# EAGLE design μDrone_v1 (EAGLE 9.6.2)
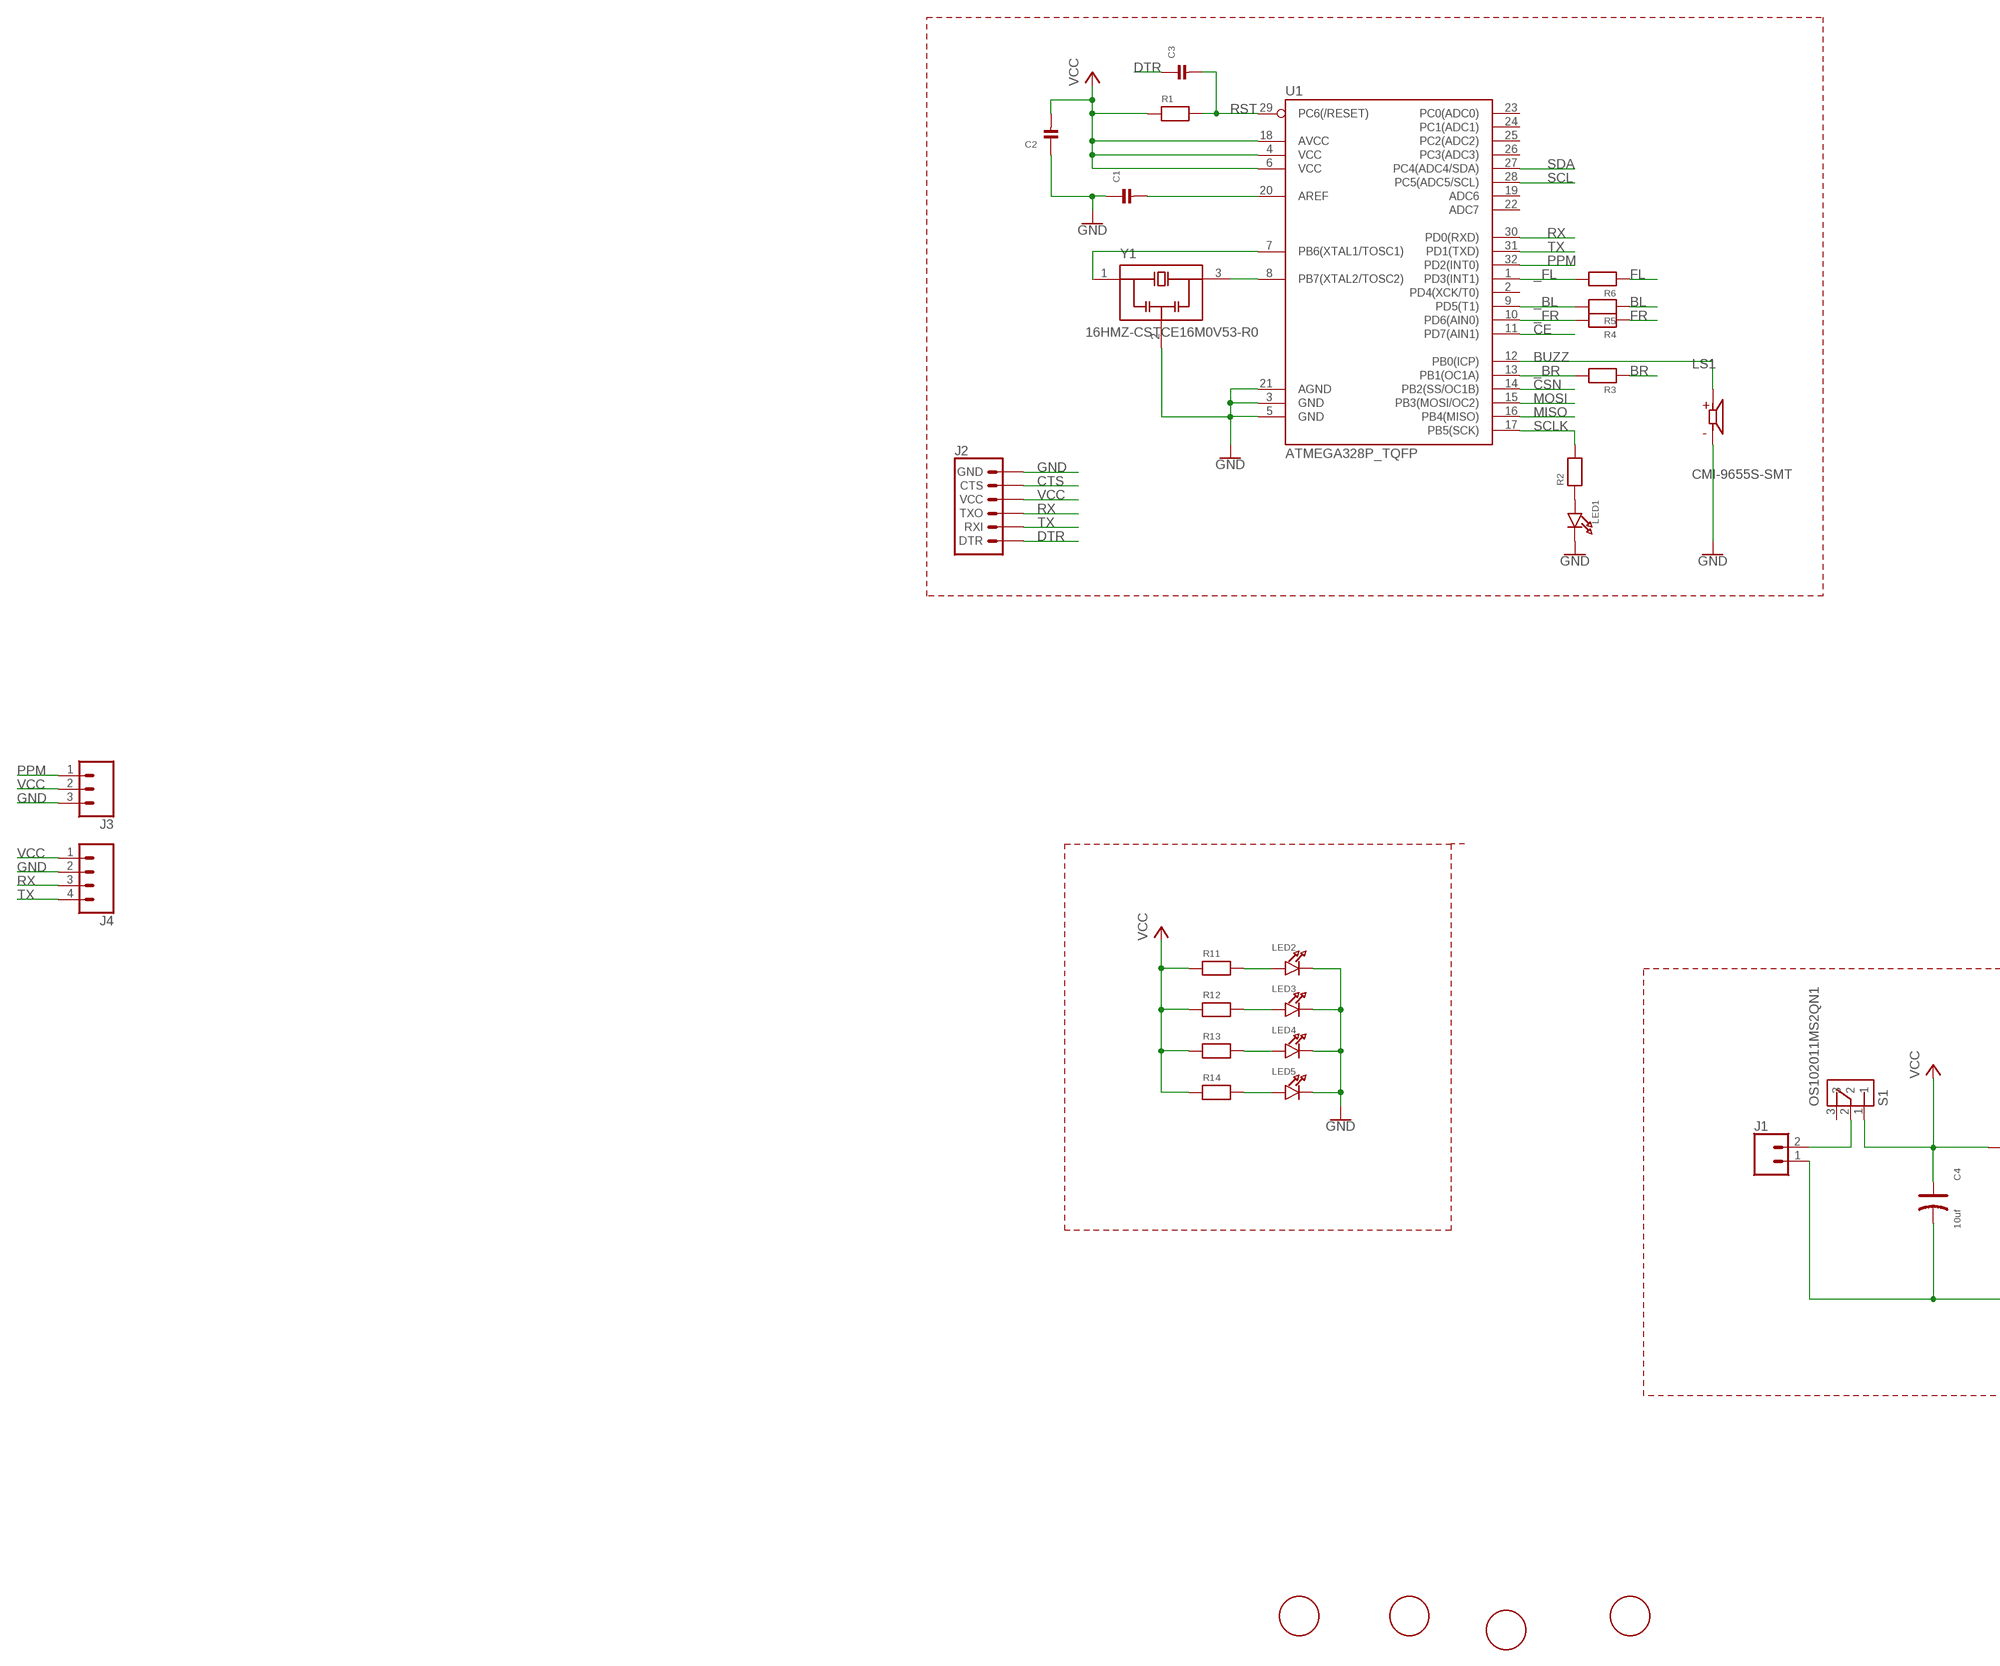
[diagram p0: schematic, sheet 1, part 1 of 2]
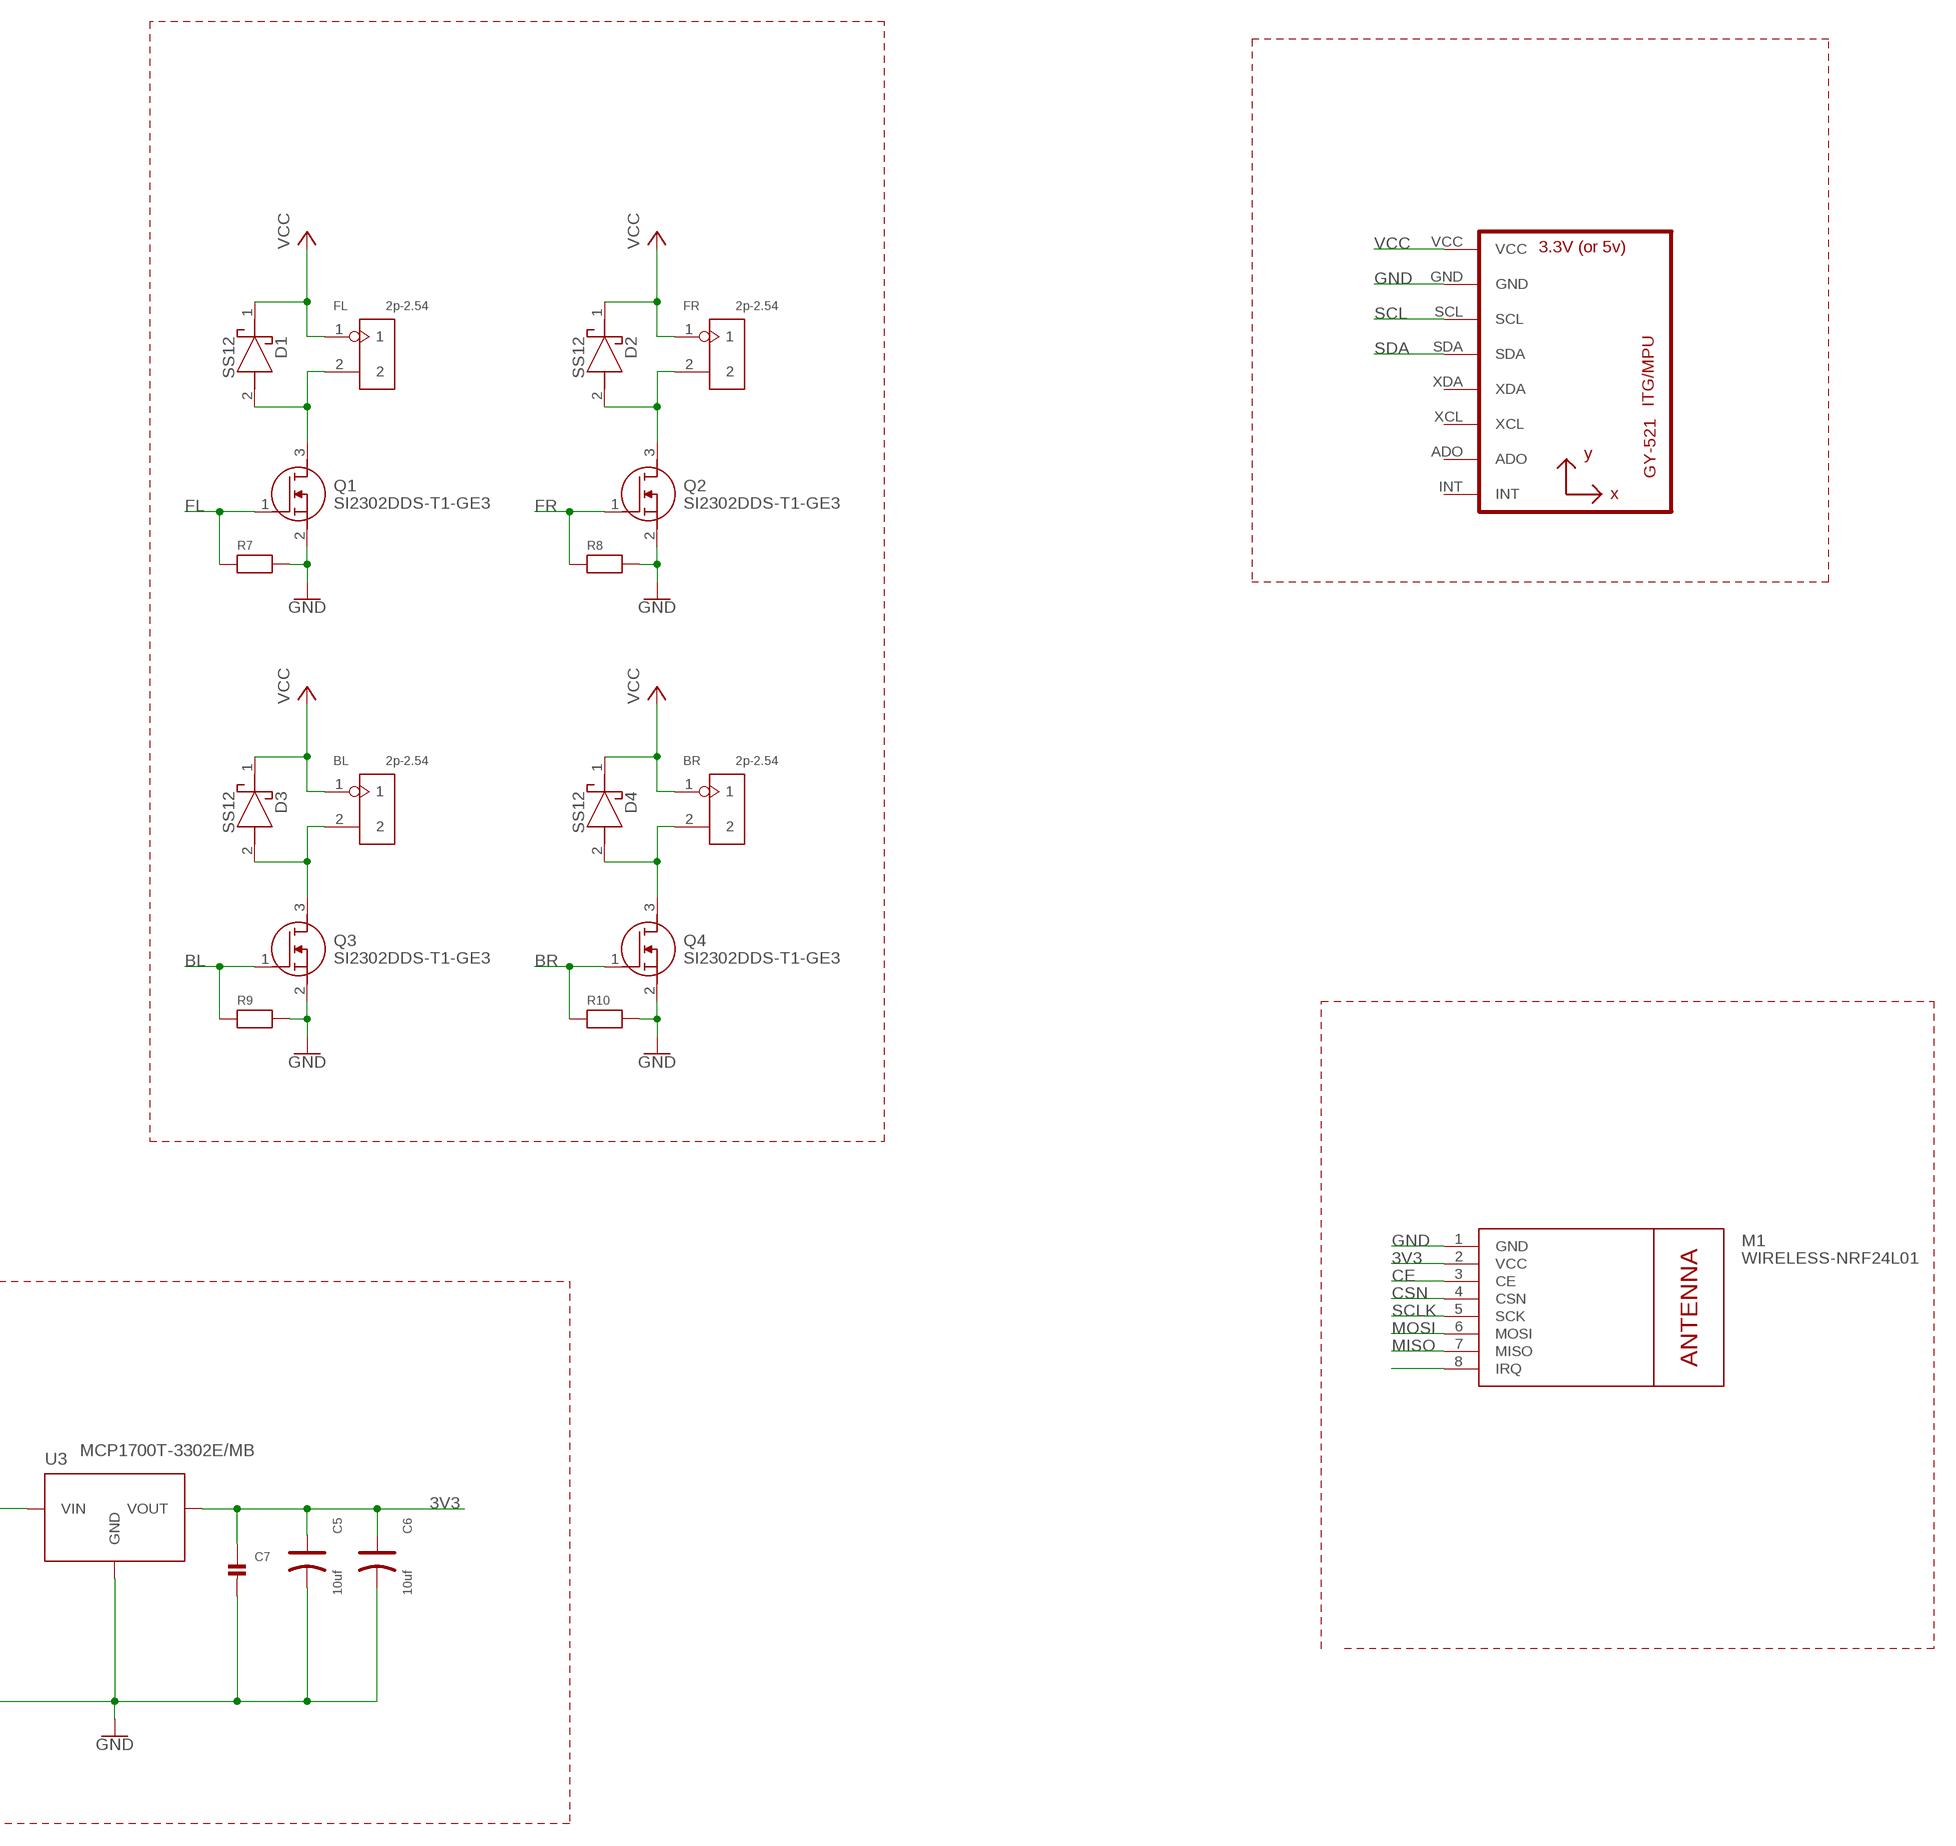
[diagram p1: schematic, sheet 1, part 2 of 2]

## Parts
BL  2p-2.54  DIP-BLACK-FEMALE-HEADER-VERT(2P-2.54)  [H2-2.54-F]
BR  2p-2.54  DIP-BLACK-FEMALE-HEADER-VERT(2P-2.54)  [H2-2.54-F]
C1  CAP_CERAMIC0805  [C0805]
C2  CAP_CERAMIC0805  [C0805]
C3  CAP_CERAMIC0805  [C0805]
C4  10uf  TANTALUM-SMD-10UF-16V-10%(AVX-A)  [AVX-A]
C5  10uf  TANTALUM-SMD-10UF-16V-10%(AVX-A)  [AVX-A]
C6  10uf  TANTALUM-SMD-10UF-16V-10%(AVX-A)  [AVX-A]
C7  CAP_CERAMIC0805  [C0805]
D1  SS12  [DIOM5227X250N]
D2  SS12  [DIOM5227X250N]
D3  SS12  [DIOM5227X250N]
D4  SS12  [DIOM5227X250N]
FL  2p-2.54  DIP-BLACK-FEMALE-HEADER-VERT(2P-2.54)  [H2-2.54-F]
FR  2p-2.54  DIP-BLACK-FEMALE-HEADER-VERT(2P-2.54)  [H2-2.54-F]
J1  CONN_02-JST-2-PTH-NO_SILK  [JST-2-PTH-NS]
J2  6_PIN_SERIAL_TARGETSILK  [6_PIN_SERIAL_TARGET_SIDE_W_SILK]
J3  CONN_03  [1X03]
J4  CONN_04  [1X04]
LED1  LED0805_NOOUTLINE  [CHIPLED_0805_NOOUTLINE]
LED2  LED0805  [CHIPLED_0805]
LED3  LED0805  [CHIPLED_0805]
LED4  LED0805  [CHIPLED_0805]
LED5  LED0805  [CHIPLED_0805]
LS1  CMI-9655S-SMT  [CUI_CMI-9655S-SMT]
M1  WIRELESS-NRF24L01  [WIRELESS-NRF24L01]
Q1  SI2302DDS-T1-GE3  [SOT95P237X112-3N]
Q2  SI2302DDS-T1-GE3  [SOT95P237X112-3N]
Q3  SI2302DDS-T1-GE3  [SOT95P237X112-3N]
Q4  SI2302DDS-T1-GE3  [SOT95P237X112-3N]
R1  RESISTOR0805  [R0805]
R2  RESISTOR0805  [R0805]
R3  RESISTOR0805  [R0805]
R4  RESISTOR0805  [R0805]
R5  RESISTOR0805  [R0805]
R6  RESISTOR0805  [R0805]
R7  RESISTOR0805  [R0805]
R8  RESISTOR0805  [R0805]
R9  RESISTOR0805  [R0805]
R10  RESISTOR0805  [R0805]
R11  RESISTOR0805  [R0805]
R12  RESISTOR0805  [R0805]
R13  RESISTOR0805  [R0805]
R14  RESISTOR0805  [R0805]
S1  OS102011MS2QN1  [SW_OS102011MS2QN1]
U1  ATMEGA328P_TQFP  [TQFP32-08]
U2  GY-521MPU6050  [GY-521]
U3  MCP1700T-3302E/MB  [MCP1700T-3302E/MB]
U$1  MICRO-DC-MOTOR-WITH-PROP  [MICRO-DC]
U$2  MICRO-DC-MOTOR-WITH-PROP  [MICRO-DC]
U$3  MICRO-DC-MOTOR-WITH-PROP  [MICRO-DC]
U$4  MICRO-DC-MOTOR-WITH-PROP  [MICRO-DC]
Y1  16HMZ-CSTCE16M0V53-R0  [OSC_CSTCE16M0V53-R0]

## Nets
3V3: C5.+ C6.+ C7.1 M1.2(VCC) U3.3(VOUT)
_BL: R5.2 U1.9(PD5(T1))
_BR: R3.2 U1.13(PB1(OC1A))
_FL: R6.2 U1.1(PD3(INT1))
_FR: R4.2 U1.10(PD6(AIN0))
BL: Q3.1(G) R5.1 R9.1
BR: Q4.1(G) R3.1 R10.1
BUZZ: LS1.P U1.12(PB0(ICP))
CE: M1.3(CE) U1.11(PD7(AIN1))
CSN: M1.4(CSN) U1.14(PB2(SS/OC1B))
CTS: J2.P$5(CTS)
DTR: C3.1 J2.P$1(DTR)
FL: Q1.1(G) R6.1 R7.1
FR: Q2.1(G) R4.1 R8.1
GND: C1.1 C2.1 C4.- C5.- C6.- C7.2 J1.1 J2.P$6(GND) J3.3 J4.2 LED1.C LED2.C LED3.C LED4.C LED5.C LS1.N M1.1(GND) Q1.2(S) Q2.2(S) Q3.2(S) Q4.2(S) R7.2 R8.2 R9.2 R10.2 U1.3(GND) U1.5(GND) U1.21(AGND) U2.GND U3.1(GND) Y1.2(GND)
IRQ: M1.8(IRQ)
MISO: M1.7(MISO) U1.16(PB4(MISO))
MOSI: M1.6(MOSI) U1.15(PB3(MOSI/OC2))
N$1: U1.8(PB7(XTAL2/TOSC2)) Y1.3(OUT)
N$2: LED1.A R2.1
N$3: C1.2 U1.20(AREF)
N$4: U1.7(PB6(XTAL1/TOSC1)) Y1.1(IN)
N$5: D2.2(A) FR.2 Q2.3(D)
N$6: D1.2(A) FL.2 Q1.3(D)
N$7: BL.2 D3.2(A) Q3.3(D)
N$8: BR.2 D4.2(A) Q4.3(D)
N$9: LED2.A R11.2
N$10: LED3.A R12.2
N$11: LED4.A R13.2
N$12: LED5.A R14.2
N$14: J1.2 S1.2
PPM: J3.1 U1.32(PD2(INT0))
RST: C3.2 R1.2 U1.29(PC6(/RESET))
RX: J2.P$2(TXO) J4.3 U1.30(PD0(RXD))
SCL: U1.28(PC5(ADC5/SCL)) U2.SCL
SCLK: M1.5(SCK) R2.2 U1.17(PB5(SCK))
SDA: U1.27(PC4(ADC4/SDA)) U2.SDA
TX: J2.P$3(RXI) J4.4 U1.31(PD1(TXD))
VCC: BL.1 BR.1 C2.2 C4.+ D1.1(K) D2.1(K) D3.1(K) D4.1(K) FL.1 FR.1 J2.P$4(VCC) J3.2 J4.1 R1.1 R11.1 R12.1 R13.1 R14.1 S1.1 U1.4(VCC) U1.6(VCC) U1.18(AVCC) U2.VCC U3.2(VIN) U3.2.1(VIN)
Unconnected: S1.3 U1.2(PD4(XCK/T0)) U1.19(ADC6) U1.22(ADC7) U1.23(PC0(ADC0)) U1.24(PC1(ADC1)) U1.25(PC2(ADC2)) U1.26(PC3(ADC3)) U2.ADO U2.INT U2.XCL U2.XDA

## Library data of the parts
BL BR FL FR = eventHorizon:DIP-BLACK-FEMALE-HEADER-VERT(2P-2.54): 320030023; MPN: F185-1102A1BSYA1
C1-C3 C7 = eventHorizon:CAP_CERAMIC: Ceramic Capacitors 0402 - 0402 Surface Mount Capacitors 16pF 50V 5% [Digikey: 445-4899-2-ND] 18pF 50V 5% [Digikey: 490-1281-2-ND] 22pF 50V 5% [Digikey: 490-1283-2-ND] 68pF 50V 5% [Digikey: 490-1289-2-ND] 0.1uF 10V 10% [Digikey: 490-1318-2-ND] 1.0uF 6.3V 10% [Digikey: 490-1320-2-ND] 0603 - 0603 Surface Mount Capacitors 16 pF 50V 5% [Digikey: 445-5051-2-ND] 22 pF 50V [Digikey: PCC220ACVTR-ND] 33 pF 50V 5% [Digikey: 490-1415-1-ND] 56pF 50V 5% [Digikey: 490-1421-1-ND] 220pF 50V 5% [Digikey: 445-1285-1-ND] 680 pF 50V 2200 pF 50V 5% C0G [Digikey: 445-1297-1-ND] 5600 pF 100V 5% X7R [Digikey: 478-3711-1-ND] 0.1 µF 25V 10% [Digikey: PCC2277TR-ND] 0.22 µF 16V 10% X7R [Digikey: 445-1318-1-ND] 1.0 µF 25V 10% [Digikey: 445-5146-2-ND] 0603 - RF Specific 3pF 250V +/-0.1pF RF [Digikey: 712-1347-1-ND] 18 pF 250V 5% [Digikey: 478-3505-1-ND or 712-1322-1-ND] 56 pF 250V 5% C0G RF [Digikey: 490-4867-1-ND] 68 pF 250V RF [Digikey: 490-4868-1-ND] 0805 - 0805 Surface Mount Capacitors 220 pF 250V 2% RF Ceramic Capacitor [Digikey: 712-1398-1-ND] 1000 pF 50V 2% NP0 Ceramic Capacitor [Digikey: 478-3760-1-ND] 0.1 µF 25V 10% Ceramic Capacitor [Digikey: PCC1828TR-ND] 1.0 µF 16V 10% Ceramic Capacitor[Digikey: 490-1691-2-ND] 10.0 µF 10V 10% Ceramic Capacitor[Digikey: 709-1228-1-ND] 10.0 uF 16V 10% Ceramic Capacitor [Digikey: 478-5165-2-ND] 47 uF 6.3V 20% Ceramic Capacitor [Digikey: 587-1779-1-ND or 399-5506-1-ND] 1206 - 1206 Surface Mount Capacitors 47uF 10V 20% Ceramic Capacitor [Digikey: 490-5528-1-ND or 399-5508-1-ND or 445-6010-1-ND] 100uF 6.3V -20%, +80% Y5V Ceramic Capacitor (Digikey: 490-4512-1-ND, Mouser: 81-GRM31CF50J107ZE1L)
C4-C6 = electroShri:TANTALUM-SMD-10UF-16V-10%(AVX-A): 302020002; MPN: TAJA106K016RNJ
D1-D4 = eventHorizon:SS12: ON Semi SS12 SMT Schottky Diode, 20V 1A, 2-Pin DO-214AC Source: Datasheet; DESCRIPTION: ON Semi SS12 SMT Schottky Diode, 20V 1A, 2-Pin DO-214AC; HEIGHT: 2.5mm; MANUFACTURER_NAME: ON Semiconductor; MANUFACTURER_PART_NUMBER: SS12; MOUSER_PART_NUMBER: 512-SS12; MOUSER_PRICE-STOCK: https://www.mouser.co.uk/ProductDetail/ON-Semiconductor-Fairchild/SS12?qs=mVVXn4M53U9WoaEpU1CO0A%3D%3D; RS_PART_NUMBER: 9034428; RS_PRICE-STOCK: https://uk.rs-online.com/web/p/products/9034428
J1 = eventHorizon:CONN_02: Multi connection point. Often used as Generic Header-pin footprint for 0.1 inch spaced/style header connections On any of the 0.1 inch spaced packages, you can populate with these: Break Away Headers - Straight (PRT-00116) Break Away Male Headers - Right Angle (PRT-00553) Female Headers (PRT-00115) Break Away Headers - Machine Pin (PRT-00117) Break Away Female Headers - Swiss Machine Pin (PRT-00743) For SCREWTERMINALS and SPRING TERMINALS visit here: Screw Terimnals on SparkFun.com (5mm/3.5mm/2.54mm spacing) This device is also useful as a general connection point to wire up your design to another part of your project. Our various solder wires solder well into these plated through hole pads. Hook-Up Wire - Assortment (Stranded, 22 AWG) (PRT-11375) Hook-Up Wire - Assortment (Solid Core, 22 AWG) (PRT-11367) View the entire wire category on our website here Special notes: Molex polarized connector foot print use with: PRT-08233 with associated crimp pins and housings. 2.54_SCREWTERM for use with PRT-10571. 3.5mm Screw Terminal footprints for PRT-08084 5mm Screw Terminal footprints for use with PRT-08432
J2 = electroShri:6_PIN_SERIAL_TARGET: 6-pin header connection for use with the "FTDI BASIC" pinout - TARGET SIDE. Also known as "Arduino Serial Program Header". It is used to mate with our FTDI Basic serial programmers using the Arduino IDE. Note, this device has "TARGET" in the name. It is intended to be used on a design that contains a target micro-controller that you wish to program. The "sister" device, named "CABLE" is inteneded to be used on a design that usually lives on the end of your USB cable and prvides the converter chip (FTDI232 or FTDI231x) to commnicate serial RX/TX. You can populate with some of these: Break Away Headers - Straight (PRT-00116) For reference (or to suit your programming needs) check out these designs: SparkFun FTDI Basic Breakout - 5V (DEV-09716) SparkFun FTDI Basic Breakout - 3.3V (DEV-09873) SparkFun FTDI SmartBasic (DEV-12935) SparkFun Beefy 3 - FTDI Basic Breakout (DEV-13746)
J3 = electroShri:CONN_03: Multi connection point. Often used as Generic Header-pin footprint for 0.1 inch spaced/style header connections On any of the 0.1 inch spaced packages, you can populate with these: Break Away Headers - Straight (PRT-00116) Break Away Male Headers - Right Angle (PRT-00553) Female Headers (PRT-00115) Break Away Headers - Machine Pin (PRT-00117) Break Away Female Headers - Swiss Machine Pin (PRT-00743) Stackable Header - 3 Pin (Female, 0.1") (PRT-13875) For SCREWTERMINALS and SPRING TERMINALS visit here: Screw Terimnals on SparkFun.com (5mm/3.5mm/2.54mm spacing) This device is also useful as a general connection point to wire up your design to another part of your project. Our various solder wires solder well into these plated through hole pads. Hook-Up Wire - Assortment (Stranded, 22 AWG) (PRT-11375) Hook-Up Wire - Assortment (Solid Core, 22 AWG) (PRT-11367) View the entire wire category on our website here Special notes: Molex polarized connector foot print use with SKU : PRT-08232 with associated crimp pins and housings.
J4 = electroShri:CONN_04: Multi connection point. Often used as Generic Header-pin footprint for 0.1 inch spaced/style header connections On any of the 0.1 inch spaced packages, you can populate with these: Break Away Headers - Straight (PRT-00116) Break Away Male Headers - Right Angle (PRT-00553) Female Headers (PRT-00115) Break Away Headers - Machine Pin (PRT-00117) Break Away Female Headers - Swiss Machine Pin (PRT-00743) For SCREWTERMINALS and SPRING TERMINALS visit here: Screw Terimnals on SparkFun.com (5mm/3.5mm/2.54mm spacing) This device is also useful as a general connection point to wire up your design to another part of your project. Our various solder wires solder well into these plated through hole pads. Hook-Up Wire - Assortment (Stranded, 22 AWG) (PRT-11375) Hook-Up Wire - Assortment (Solid Core, 22 AWG) (PRT-11367) View the entire wire category on our website here Special notes: Molex polarized connector foot print use with SKU : PRT-08231 with associated crimp pins and housings. 1MM SMD Version SKU: PRT-10208; PROD_ID: CONN-09696
LED1-LED5 = eventHorizon:LED: LED 0603 - 0603 Surface Mount Package 2mA: Green LED - Low Power (3.9mcd, 2ma, 1.7Vf) - Digikey: 475-2709-2-ND Orange LED - Low Power (9.8mcd, 2ma, 1.8Vf) - Digikey: 475-1194-2-ND Red LED - Low Power (5mcd, 2ma, 1.8Vf) - Digikey: 475-1195-2-ND Yellow LED - Low Power (7mcd, 2ma, 1.8Vf) - Digikey: 475-1196-2-ND 5mA: Blue LED - Low Power (17mcd, 5ma, 2.9Vf) - Digikey: LNJ937W8CRACT-ND 0805 - 0805 Surface Mount Package 2mA: Red LED (8.8mcd, 2mA, 1.8Vf, Clear) - Low Power [Digikey: 475-2510-1-ND] Green LED (5mcd, 2mA, 1.8Vf, Clear) - Low Power [Digikey: 475-2730-1-ND] Yellow LED (11.3mcd, 2mA, 1.8Vf, Clear) - Low Power [Digikey: 475-2555-1-ND] 20mA: Red LED (104mcd, 20mA, Diffused) - LS R976 [Digikey: 475-1278-6-ND] Red LED (12mcd, 20mA, 2.0Vf, Clear) - APT2012EC [Digikey: 754-1128-1-ND] Green LED (15mcd, 20mA, 2.2Vf, Clear) - APT2012GC [Digikey: 754-1131-1-ND] Orange LED (160mcd, 20mA, 2.1Vf, Clear) - APT2012SECK [Digikey: 754-1130-1-ND] 1206 - 1206 Surface Mount Package Green LED (26mcd, 20mA, Diffused) - LG N971 [Digikey: 475-1407-6-ND] Red LED (15mcd, 20mA, Diffused) - LH N974 [Digikey: 475-1416-6-ND]
LS1 = electroShri:CMI-9655S-SMT: 9.6 mm, 5 Vdc, 85 dB, 2.7 kHz, Surface Mount (SMT), Driving Circuit, Magnetic Audio Indicator Buzzer; AVAILABILITY: Unavailable; CUI_PURCHASE_URL: https://www.cuidevices.com/product/audio/buzzers/audio-indicators/cmi-9655s-smt-tr?utm_source=snapeda.com&utm_medium=referral&utm_campaign=snapedaBOM; DESCRIPTION: 9.6 mm, 5 Vdc, 85 dB, 2.7 kHz, Surface Mount (SMT), Driving Circuit, Magnetic Audio Indicator Buzzer; MF: CUI Devices; MP: CMI-9655S-SMT-TR; PACKAGE: CUI Inc.; PRICE: None
M1 = eventHorizon:WIRELESS-NRF24L01: 2.4 GHz Wireless Module based on NRF24L01 chip More details available here: http://www.electrodragon.com/w/NRF24L01 Click here to find device on ebay.com
Q1-Q4 = eventHorizon:SI2302DDS-T1-GE3: SI2302DDS-T1-GE3 N-Channel MOSFET, 2.6 A, 20 V, 3-Pin SOT-363 Vishay Source: Datasheet; ALLIED_NUMBER: 70459664; ALLIED_PRICE-STOCK: https://www.alliedelec.com/siliconix-vishay-si2302dds-t1-ge3/70459664/; DESCRIPTION: SI2302DDS-T1-GE3 N-Channel MOSFET, 2.6 A, 20 V, 3-Pin SOT-363 Vishay; HEIGHT: 1.12mm; MANUFACTURER_NAME: Vishay; MANUFACTURER_PART_NUMBER: SI2302DDS-T1-GE3; MOUSER_PART_NUMBER: 78-SI2302DDS-T1-GE3; MOUSER_PRICE-STOCK: https://www.mouser.co.uk/ProductDetail/Vishay-Semiconductors/SI2302DDS-T1-GE3?qs=MxnWX8BLHKdaCSNWhg%252BxLA%3D%3D; RS_PART_NUMBER: 1526358P; RS_PRICE-STOCK: http://uk.rs-online.com/web/p/products/1526358P
R1-R14 = eventHorizon:RESISTOR: Resistors 0402 - 0402 Surface Mount Package 22 Ohm 1% 1/16W [Digikey: 311-22.0LRTR-ND] 33 Ohm 5% 1/16W 1.0K 5% 1/16W 1.5K 5% 1/16W 2.0K 1% 1/16W 10.0K 1% 1/16W [Digikey: 311-10.0KLRTR-ND] 10.0K 5% 1/16W [Digikey: RMCF0402JT10K0TR-ND] 12.1K 1% 1/16W [Digikey: 311-22.0LRTR-ND] 100.0K 5% 1/16W 0603 - 0603 Surface Mount Package 0 Ohm 1/10 Watt 1% Resistor 15 Ohm 1/10 Watt 1% Resistor 33 Ohm 1/10 Watt 1% Resistor 49.9 Ohm 1/10 Watt 1% Resistor 100 Ohm 1/10 Watt 1% Resistor 150 Ohm 1/10 Watt 1% Resistor 240 Ohm 1/10 Watt 1% Resistor 390 Ohm 1/10 Watt 1% Resistor 560 Ohm 1/10 Watt 1% Resistor 680 Ohm 1/10 Watt 1% Resistor 750 Ohm 1/10 Watt 1% Resistor 1.0K Ohm 1/10 Watt 1% Resistor 1.5K Ohm 1/10 Watt 1% Resistor 2.0K Ohm 1/10 Watt 1% Resistor 2.2K Ohm 1/10 Watt 1% Resistor 3.3K Ohm 1/10 Watt 1% Resistor 4.7K Ohm 1/10 Watt 1% Resistor 10.0K Ohm 1/10 Watt 1% Resistor 12.0K Ohm 1/10 Watt 1% Resistor 12.1K Ohm 1/10 Watt 1% Resistor 20.0K Ohm 1/10 Watt 1% Resistor 33.0K Ohm 1/10 Watt 1% Resistor 100.0K Ohm 1/10 Watt 1% Resistor 0805 - 0805 Surface Mount Package 0 Ohm 1/8 Watt 1% Resistor 33 Ohm 1/8 Watt 1% Resistor 100 Ohm 1/8 Watt 1% Resistor 150 Ohm 1/8 Watt 1% Resistor 200 Ohm 1/8 Watt 1% Resistor 240 Ohm 1/8 Watt 1% Resistor 330 Ohm 1/8 Watt 1% Resistor 390 Ohm 1/8 Watt 1% Resistor 470 Ohm 1/8 Watt 1% Resistor 1.0K Ohm 1/8 Watt 1% Resistor 1.5K Ohm 1/8 Watt 1% Resistor 2.0K Ohm 1/8 Watt 1% Resistor 4.7K Ohm 1/8 Watt 1% Resistor 5.1K Ohm 1/8 Watt 1% Resistor 5.6K Ohm 1/8 Watt 1% Resistor 10.0K Ohm 1/8 Watt 1% Resistor 22.0K Ohm 1/8 Watt 1% Resistor 33.0K Ohm 1/8 Watt 1% Resistor 100K Ohm 1/8 Watt 1% Resistor 1206 - 1206 Surface Mount Package 2012 - 2010 Surface Mount Package 0.11 Ohm 1/2 Watt 1% Resistor - Digikey: RHM.11UCT-ND
S1 = electroShri:OS102011MS2QN1: Switch Slide ON ON SPDT Top Slide 0.1A 12VDC 10000Cycles PC Pins Thru-Hole Bulk; DESCRIPTION: SLIDE SWITCH SPDT T/H ON-ON BBM; DIGI-KEY_PART_NUMBER: CKN12284-ND; DIGIKEY-PURCHASE-URL: https://snapeda.com/shop?store=DigiKey&id=391519; MF: C&K; MP: OS102011MS2QN1; PACKAGE: None
U1 = SparkFun-IC-Microcontroller:ATMEGA328P_TQFP: Popular 328P in QFP Storefront component: ATmega328 - TQFP (COM-13448) Datasheet SparkFun Products SparkFun RedBoard - Programmed with Arduino (DEV-12757) Arduino Pro Mini 328 - 5V/16MHz (DEV-11113) Arduino Pro Mini 328 - 3.3V/8MHz (DEV-11114) SparkFun OpenLog (DEV-13712) SparkFun MicroView - OLED Arduino Module (DEV-12923) SparkFun Digital Sandbox (DEV-12651) SparkFun PicoBoard (WIG-11888) Arduino Fio (DEV-10116) LilyPad Arduino 328 Main Board (DEV-13342) SparkFun RedStick (DEV-13741) LilyPad MP3 (DEV-11013) LilyPad Arduino SimpleSnap (DEV-10941) SparkFun Stepoko (ROB-13899) SparkFun Geiger Counter (SEN-11345) SparkFun EL Sequencer (COM-12781) Arduino Pro 328 - 5V/16MHz (DEV-10915) CryptoCape (DEV-12773) SparkFun IR Thermometer Evaluation Board - MLX90614 (SEN-10740) SparkFun RedBot Mainboard (ROB-12097) Arduino Pro 328 - 3.3V/8MHz (DEV-10914) SparkFun Block for Intel® Edison - Arduino (DEV-13036) SparkFun Simon Says - Surface Mount Soldering Kit (KIT-10935) SparkFun 7-Segment Serial Display - Red (COM-11441) SparkFun 7-Segment Serial Display - White (COM-11629) SparkFun 7-Segment Serial Display - Yellow (COM-11443) SparkFun 7-Segment Serial Display - Kelly Green (COM-11440) SparkFun 7-Segment Serial Display - Blue (COM-11442) SparkFun OpenSegment Serial Display - 20mm (Blue) (COM-11647) SparkFun OpenSegment Serial Display - 20mm (Green) (COM-11646) SparkFun OpenSegment Serial Display - 20mm (White) (COM-11648) SparkFun OpenSegment Serial Display - 20mm (Red) (COM-11644) SparkFun OpenSegment Serial Display - 20mm (Yellow) (COM-11645) SparkFun OpenSegment Shield (DEV-13190); PROD_ID: IC-09069
U2 = eventHorizon:GY-521
U3 = electroShri:MCP1700T-3302E/MB: 250mA CMOS LDO, Isupply 1uA and 2% Vout Accuracy 3 SOT-89 T/R; AVAILABILITY: Unavailable; DESCRIPTION: Linear Voltage Regulator IC 1 Output 250mA SOT-89-3; MF: Microchip; MP: MCP1700T-3302E/MB; PACKAGE: SOT-89 Microchip; PRICE: None
U$1-U$4 = eventHorizon:MICRO-DC-MOTOR-WITH-PROP
Y1 = eventHorizon:16HMZ-CSTCE16M0V53-R0: Ceramic Resonator 16MHz ??0.5% (Tol) ??0.3% (Stability) 15pF 40Ohm 3-Pin CSMD T/R; AVAILABILITY: Unavailable; DESCRIPTION: 16MHz Ceramic Resonator Built in Capacitor 15pF ±0.3% -20°C ~ 80°C Surface Mount; MF: Murata; MP: CSTCE16M0V53-R0; PACKAGE: SMD-3 Murata; PRICE: None

## Board
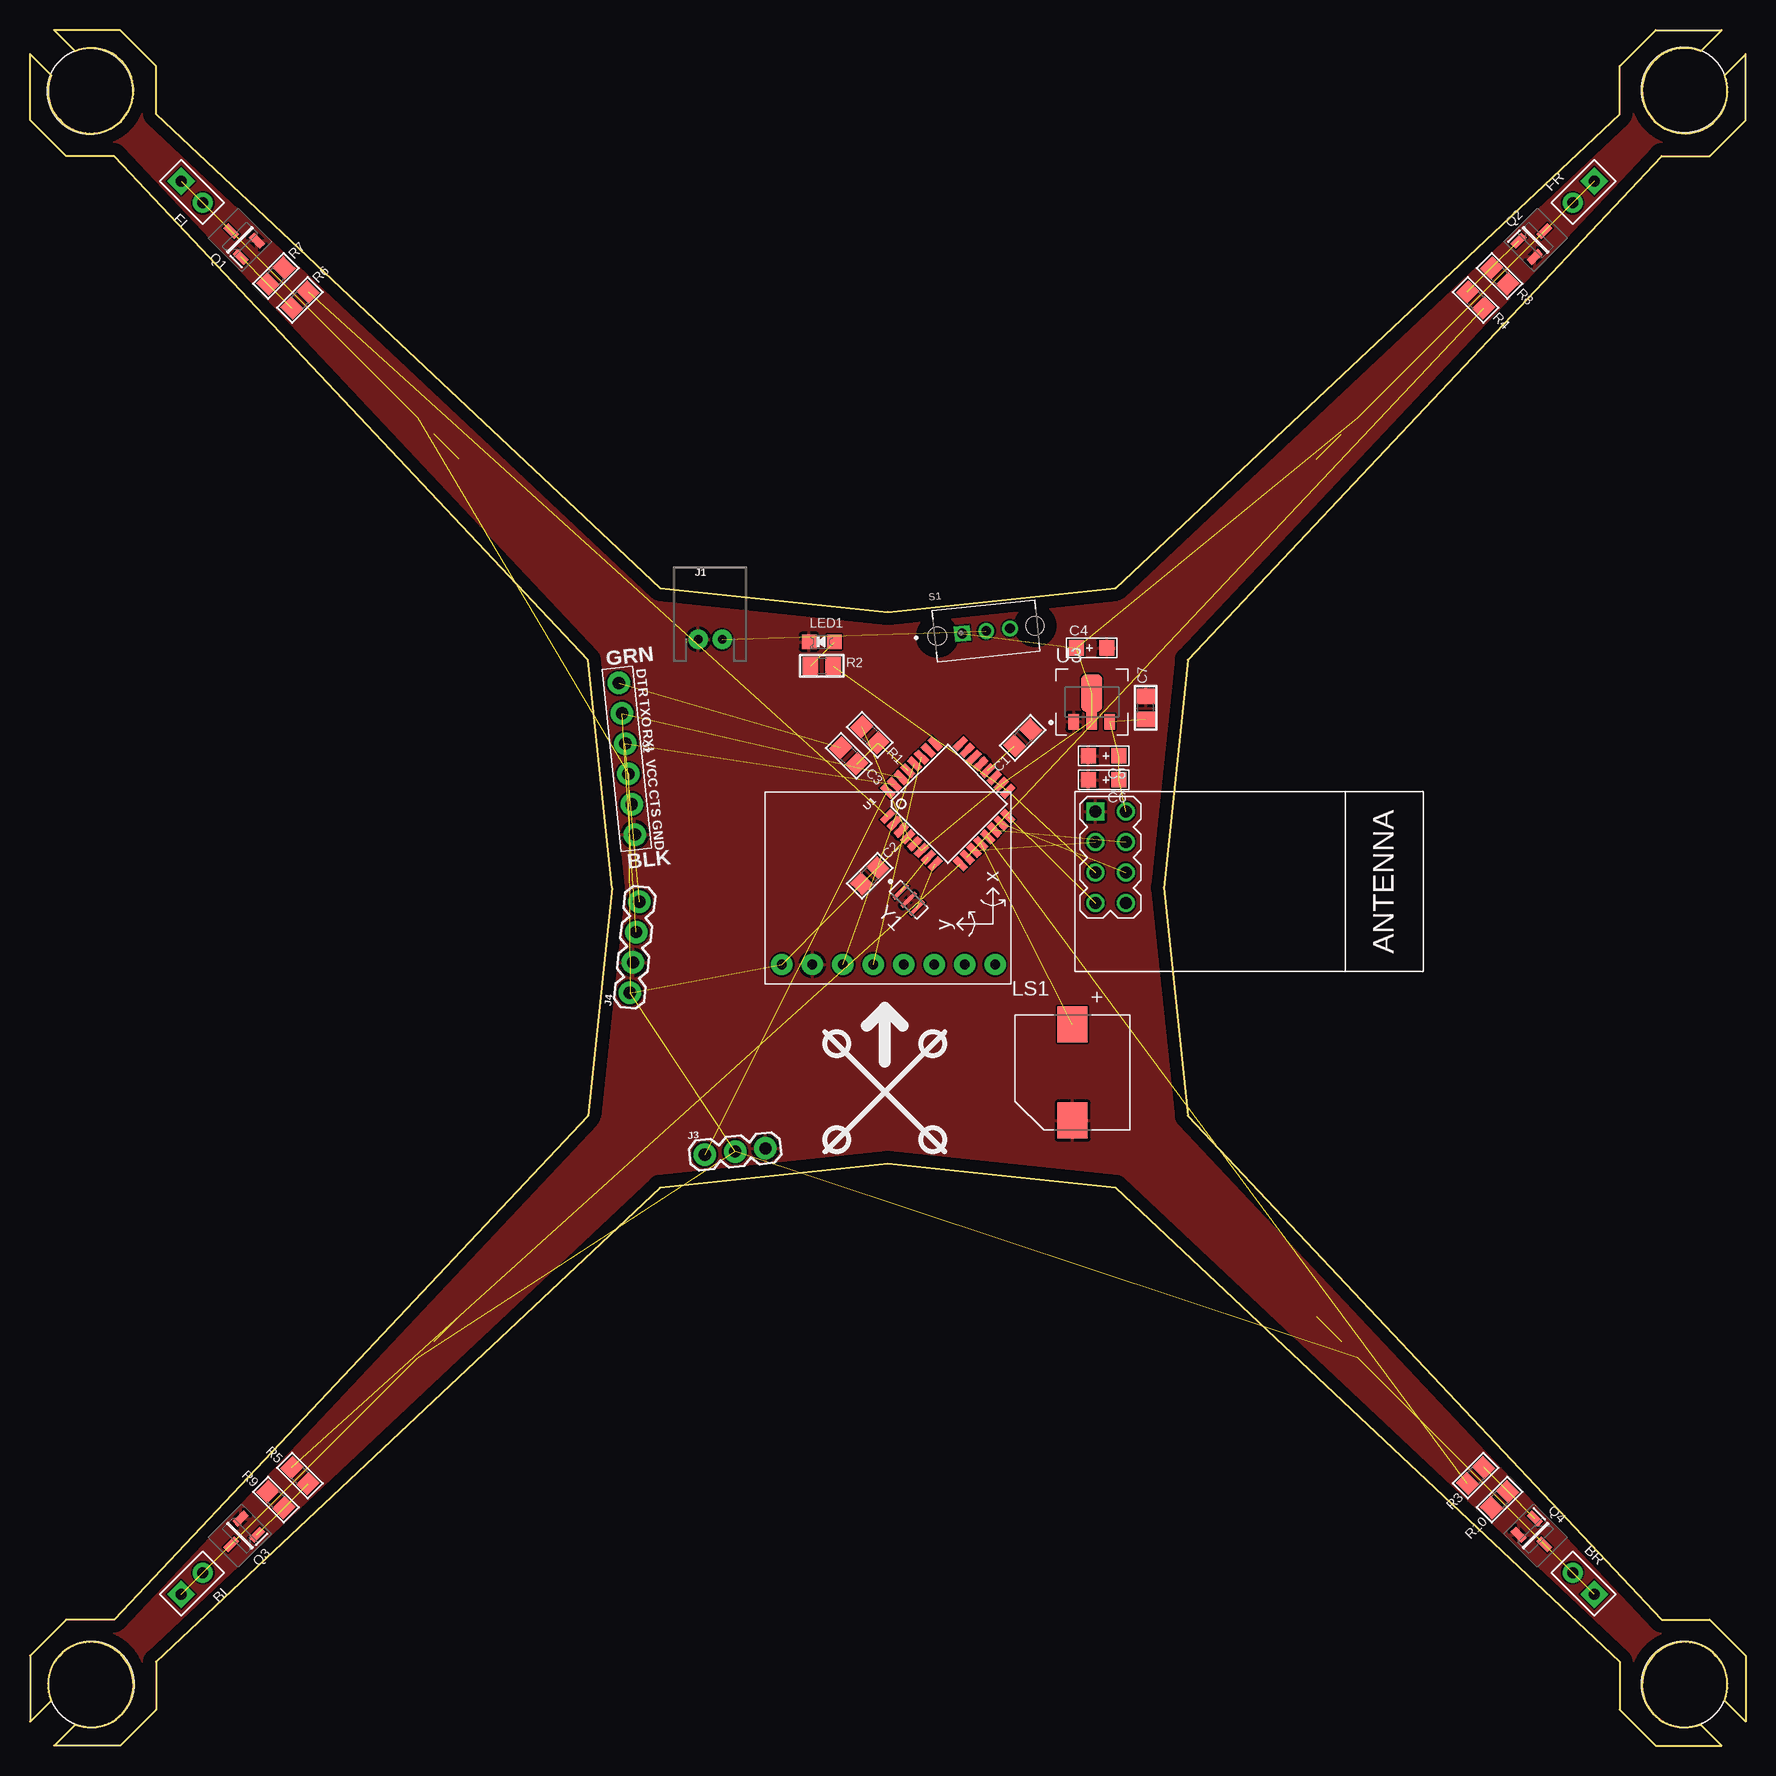
[diagram p2: board, top side]
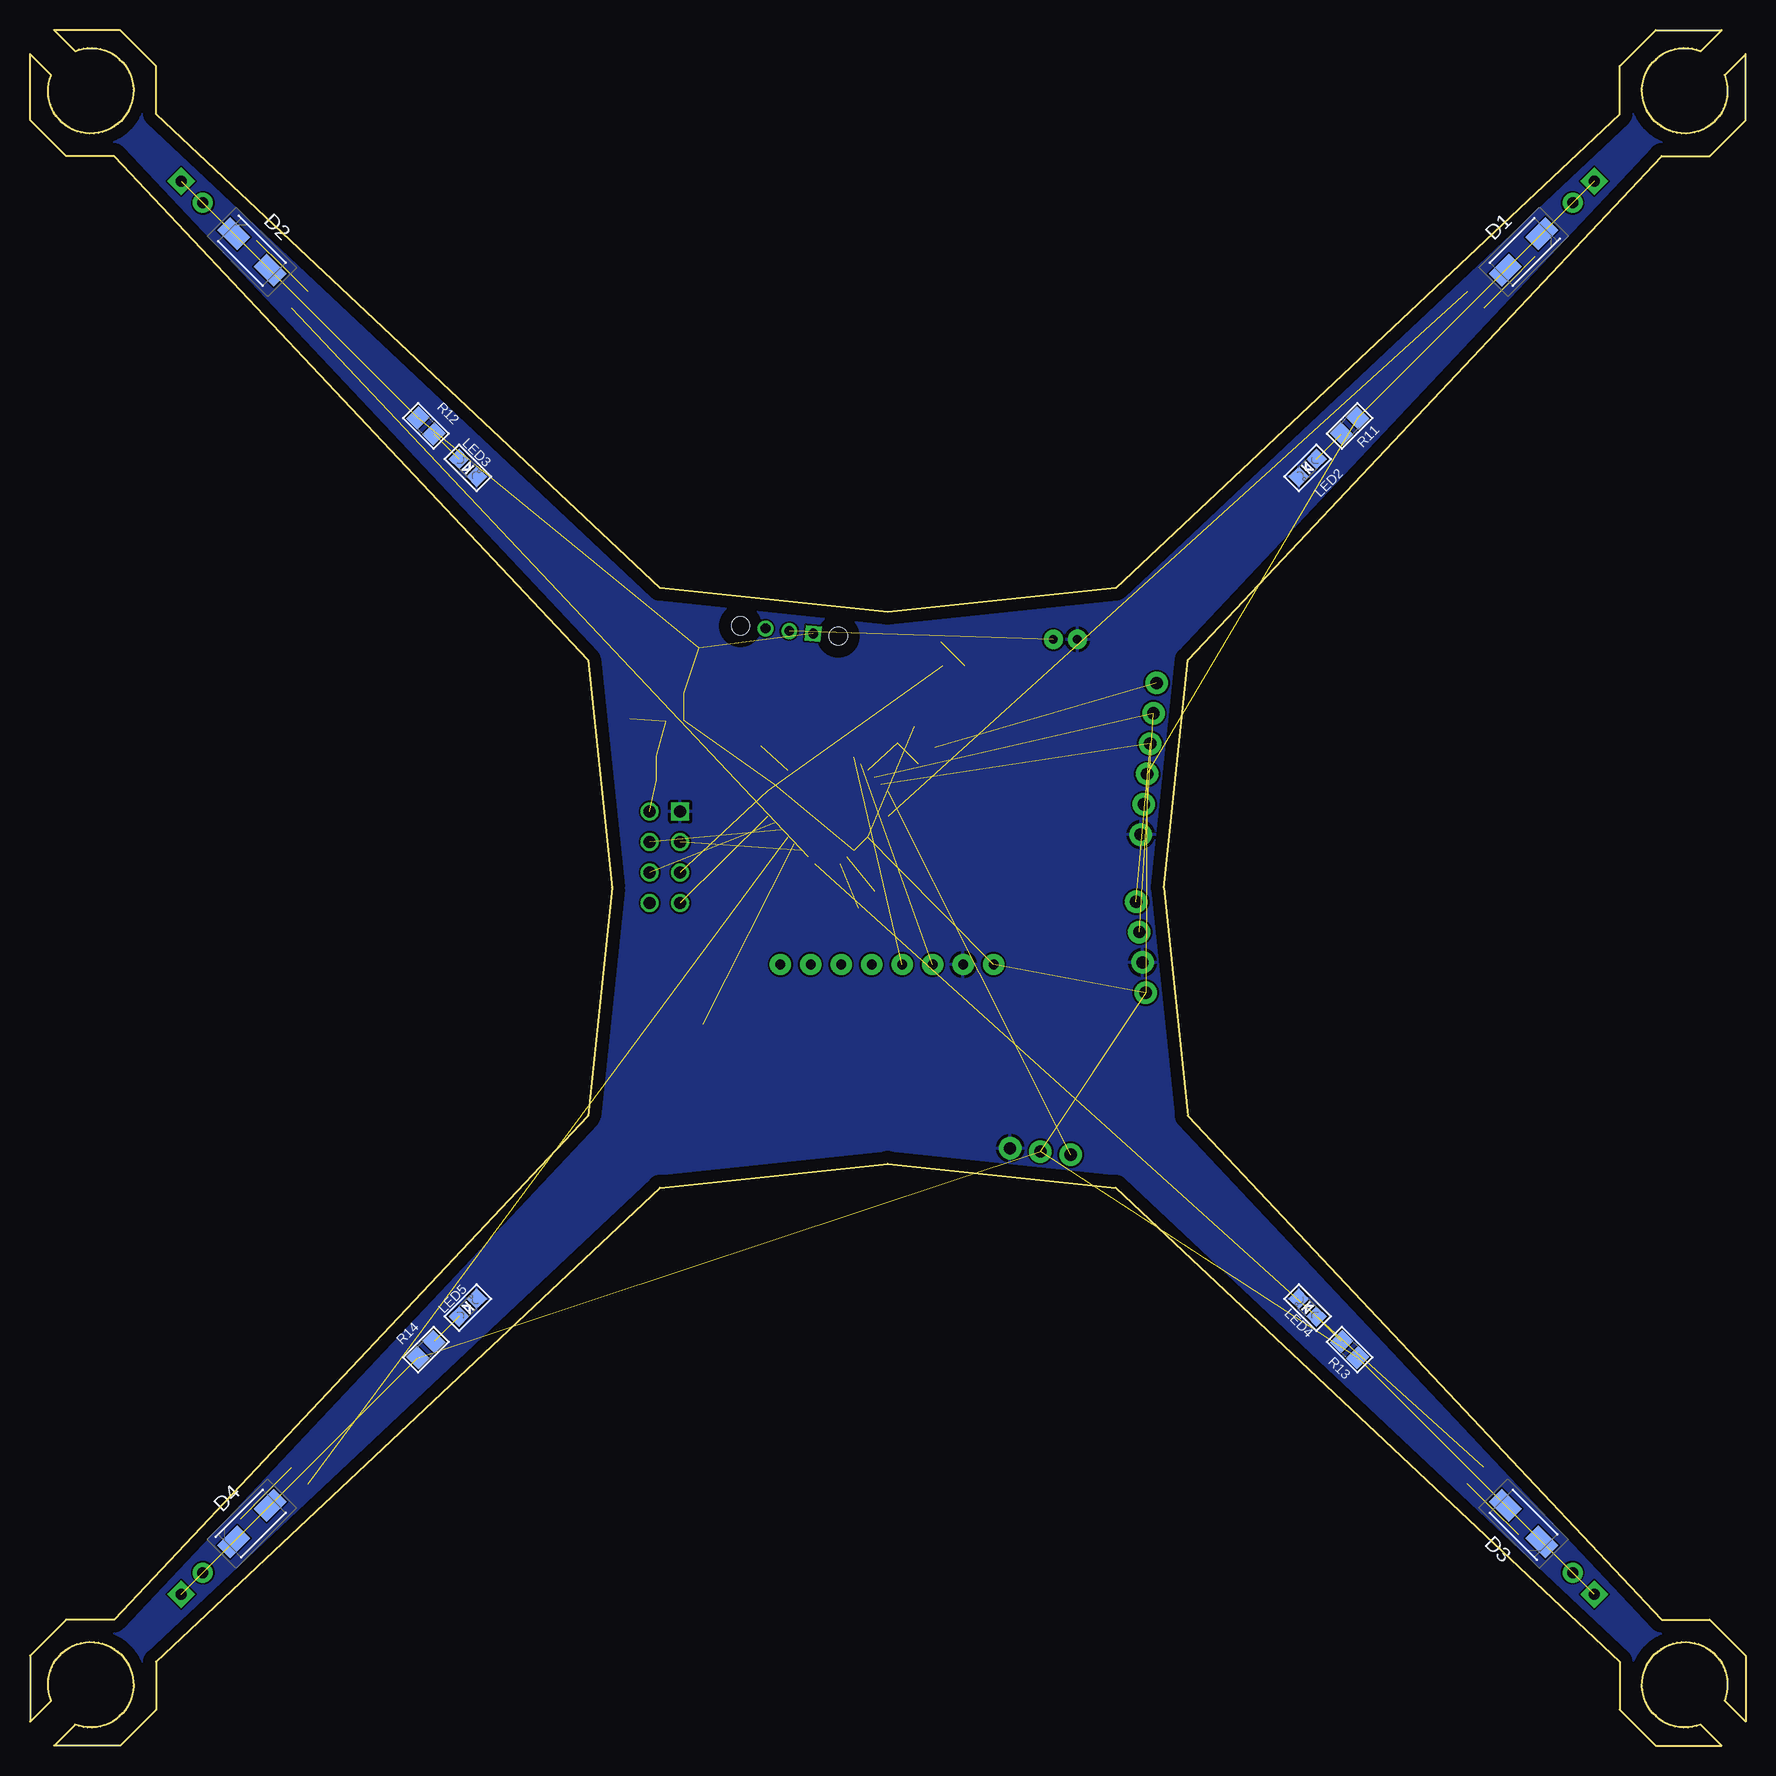
[diagram p3: board, bottom side, seen from below]

Size 143 x 143 mm. Coordinates in mm from the lower left corner, seen from the top.
Outline: 132.5,136 132.5,140 135.5,143 141,143 139.25,141.25 arc313 141.25,139.25 143,141 143,135.5 140,132.5 136,132.5 96.5,90.5 94.5,71.5 96.5,52.5 136,10.5 140,10.5 143,7.5 143,2 141.25,3.75 arc313 139.25,1.75 141,0 135.5,0 132.5,3 132.5,7 90.5,46.5 71.5,48.5 52.5,46.5 10.5,7 10.5,3 7.5,0 2,0 3.75,1.75 arc313 1.75,3.75 0,2 0,7.5 3,10.5 7,10.5 46.5,52.5 48.5,71.5 46.5,90.5 7,132.5 3,132.5 0,135.5 0,141 1.75,139.25 arc313 3.75,141.25 2,143 7.5,143 10.5,140 10.5,136 52.5,96.5 71.5,94.5 90.5,96.5 132.5,136
Copper layers (1*16): Top 0.035mm / dielectric 1.5mm / Bottom 0.035mm
Design rules "default": minimum track width 6mil, minimum drill 0.35mm, track to track 6mil, track to pad 6mil, pad to pad 6mil, via to via 6mil, smd to smd 6mil, copper to edge 40mil, drill to drill 6mil, minimum pad ring 10mil, minimum via ring 8mil, stop-mask expansion 4mil, vias tented up to drill 0mil, thermal gap 10mil

### Footprints (pad centres in the part's own frame; a part is rotated, then mirrored left to right if it is on the bottom)
H2-2.54-F = drill 0.889 pad 1.651 square: 1 0,1.27 | drill 0.889 pad 1.651: 2 0,-1.27
C0805 = smd 1.3 x 1.5: 1 -0.95,0; 2 0.95,0
AVX-A = smd 1.27 x 1.27: + -1.27,0; - 1.27,0
DIOM5227X250N = smd 2.35 x 1.55: 1 -2.15,0; 2 2.15,0
JST-2-PTH-NS = drill 0.7 pad 1.6: 1 -1,0; 2 1,0
6_PIN_SERIAL_TARGET_SIDE_W_SILK = drill 1.016 pad 1.88: P$1 -6.35,0; P$2 -3.81,0; P$3 -1.27,0; P$4 1.27,0; P$5 3.81,0; P$6 6.35,0
1X03 = drill 1.016 pad 1.88: 1 0,0; 2 2.54,0; 3 5.08,0
1X04 = drill 1.016 pad 1.88: 1 0,0; 2 2.54,0; 3 5.08,0; 4 7.62,0
CHIPLED_0805_NOOUTLINE = smd 1.2 x 1.2: A 0,-1.05; C 0,1.05
CHIPLED_0805 = smd 1.2 x 1.2: A 0,-1.05; C 0,1.05
CUI_CMI-9655S-SMT = smd 2.5 x 3: N 0,-4; P 0,4
WIRELESS-NRF24L01 = drill 1 square: 1 -12.7,6.35 | drill 1: 2 -10.16,6.35; 3 -12.7,3.81; 4 -10.16,3.81; 5 -12.7,1.27; 6 -10.16,1.27; 7 -12.7,-1.27; 8 -10.16,-1.27
SOT95P237X112-3N = smd 1.3 x 0.6: 1 -1.05,0.95; 2 -1.05,-0.95; 3 1.05,0
R0805 = smd 1.3 x 1.5: 1 -0.95,0; 2 0.95,0
SW_OS102011MS2QN1 = drill 0.8 square: 1 -2,0 | drill 0.8: 2 0,0; 3 2,0 | hole 1.5: -4.1,0; 4.1,0
TQFP32-08 = smd 1.27 x 0.559: 1 -4.293,2.8; 2 -4.293,2; 3 -4.293,1.2; 4 -4.293,0.4; 5 -4.293,-0.4; 6 -4.293,-1.2; 7 -4.293,-2; 8 -4.293,-2.8; 17 4.293,-2.8; 18 4.293,-2; 19 4.293,-1.2; 20 4.293,-0.4; 21 4.293,0.4; 22 4.293,1.2; 23 4.293,2; 24 4.293,2.8 | smd 0.559 x 1.27: 9 -2.8,-4.293; 10 -2,-4.293; 11 -1.2,-4.293; 12 -0.4,-4.293; 13 0.4,-4.293; 14 1.2,-4.293; 15 2,-4.293; 16 2.8,-4.293; 25 2.8,4.293; 26 2,4.293; 27 1.2,4.293; 28 0.4,4.293; 29 -0.4,4.293; 30 -1.2,4.293; 31 -2,4.293; 32 -2.8,4.293
GY-521 = drill 0.8 pad 1.778: ADO -6.397,-6.418; GND -6.397,6.282; INT -6.397,-8.957; SCL -6.397,3.743; SDA -6.397,1.202; VCC -6.397,8.822; XCL -6.397,-3.877; XDA -6.397,-1.337
MCP1700T-3302E/MB = smd 0.9 x 1.3: 1 -1.5,-1.65; 3 1.5,-1.65 | smd 0.9 x 1.475: 2 0,-1.562 | smd 1.733 x 3.125: 2.1 0,0.738
OSC_CSTCE16M0V53-R0 = smd 0.3 x 1.6: 1 -0.95,0; 2 0,0; 3 0.95,0

### Placement (x,y rotation side)
BL  13.5,13.5 135 top
BR  129.5,13.5 225 top
C1  82.75,84 225 top
C2  70,72.5 45 top
C3  68.25,82.5 315 top
C4  88.5,91.5 0 top
C5  89.5,82.5 180 top
C6  89.5,80.5 180 top
C7  93,86.5 90 top
D1  18.5,124.5 225 bottom
D2  124.5,124.5 315 bottom
D3  18.5,18.5 135 bottom
D4  124.5,18.5 45 bottom
FL  13.5,129.5 45 top
FR  129.5,129.5 315 top
J1  56.7,92.2 0 top
J2  49.75,82.25 276 top
J3  56.25,49.25 6 top
J4  50,62.75 84 top
LED1  66,92 90 top
LED2  36.5,106.5 135 bottom
LED3  106.5,106.5 225 bottom
LED4  36.5,36.5 45 bottom
LED5  106.5,36.5 315 bottom
LS1  86.9,56.1 0 top
M1  101.5,71.5 0 top
Q1  17.5,125.5 135 top
Q2  125.5,125.5 45 top
Q3  17.5,17.5 225 top
Q4  125.5,17.5 315 top
R1  70,84.25 315 top
R2  66,90 0 top
R3  120.5,22.5 225 top
R4  120.5,120.5 315 top
R5  22.5,22.5 135 top
R6  22.5,120.5 45 top
R7  20.5,122.5 45 top
R8  122.5,122.5 315 top
R9  20.5,20.5 135 top
R10  122.5,20.5 225 top
R11  33,110 225 bottom
R12  110,110 315 bottom
R13  33,33 135 bottom
R14  110,33 45 bottom
S1  79.7,92.9 6 top
U1  76.5,78.5 45 top
U2  71.5,71.5 90 top
U3  88.5,87 0 top
U$1  5.1,5.1 0 top
U$2  5,137.9 0 top
U$3  137.9,138 0 top
U$4  137.9,5.1 0 top
Y1  73.25,70.5 315 top

### Tracks (layer width: path | path; a pad name or v marks a point on that pad's centre or on a via)
3V3  (4 unrouted)
_BL  (1 unrouted)
_BR  (1 unrouted)
_FL  (1 unrouted)
_FR  (1 unrouted)
BL  (2 unrouted)
BR  (2 unrouted)
BUZZ  (1 unrouted)
CE  (1 unrouted)
CSN  (1 unrouted)
DTR  (1 unrouted)
FL  (2 unrouted)
FR  (2 unrouted)
GND
  pour Top: -0.5,-0.5 -0.5,143.5 143.5,143.5 143.5,-0.5
  pour Bottom: -2.5,-3.5 -2.5,146.5 146.5,146.5 146.5,-3.5
MISO  (1 unrouted)
MOSI  (1 unrouted)
N$1  (1 unrouted)
N$2  (1 unrouted)
N$3  (1 unrouted)
N$4  (1 unrouted)
N$5  (2 unrouted)
N$6  (2 unrouted)
N$7  (2 unrouted)
N$8  (2 unrouted)
N$9  (1 unrouted)
N$10  (1 unrouted)
N$11  (1 unrouted)
N$12  (1 unrouted)
N$14  (1 unrouted)
PPM  (1 unrouted)
RST  (2 unrouted)
RX  (2 unrouted)
SCL  (1 unrouted)
SCLK  (2 unrouted)
SDA  (1 unrouted)
TX  (2 unrouted)
VCC  (24 unrouted)